# Altium schematic sheet CAN Termination Connector.SchDoc
size A4
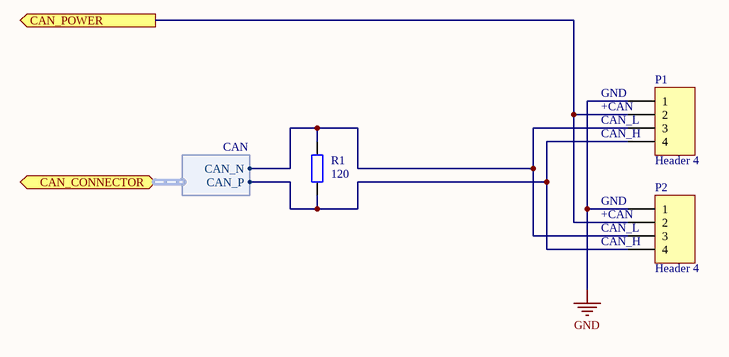
[diagram p0: CAN Termination Connector.SchDoc]

## Parts
P1  Header 4  [87437-0443]
P2  Header 4  [87437-0443]
R1  value 120  [R0603]  (hidden comment: Res2)

## Ports
CAN_CONNECTOR (harness CAN), CAN_POWER (out)

## Harnesses
CAN: CAN_N, CAN_P

## Nets
GND: P1.1 P2.1
CAN_POWER: P1.2 P2.2 ; port CAN_POWER
NetP1_3: P1.3 P2.3 R1.2 ; port CAN_CONNECTOR.CAN_N
NetP1_4: P1.4 P2.4 R1.1 ; port CAN_CONNECTOR.CAN_P

## Notes on the sheet
- (near P1) GND
- (near P1) +CAN
- (near P1) CAN_L
- (near P1) CAN_H
- (near P2) GND
- (near P2) +CAN
- (near P2) CAN_L
- (near P2) CAN_H

## Library data of the parts
P1 P2 = Header 4: Header, 4-Pin; LatestRevisionDate: 17-Jul-2002; LatestRevisionNote: Re-released for DXP Platform.; Publisher: Altium Limited; farnell: 1711320
R1 = Res2: Resistor; Published: 8-Jun-2000; LatestRevisionDate: 17-Jul-2002; LatestRevisionNote: Re-released for DXP Platform.; PackageReference: AXIAL-0.4; Publisher: Altium Limited; farnell: 9330496